# EAGLE schematic controller (EAGLE 6.6.0)
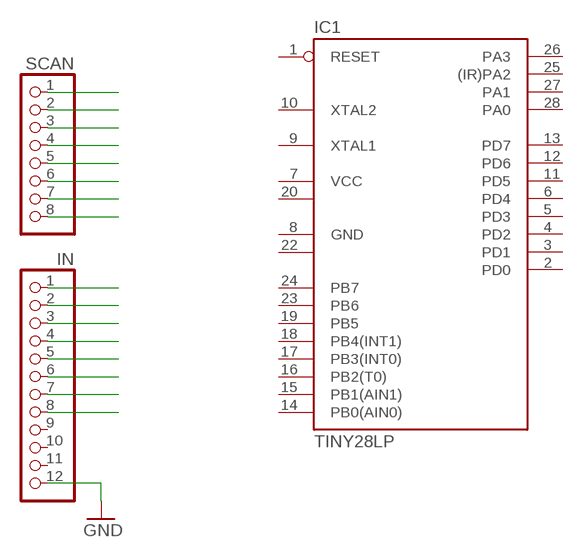
[diagram p0: schematic, sheet 1]

## Parts
IC1  TINY28LP  [DIL28-3]
IN  PINHD-1X12/90  [1X12/90]
SCAN  PINHD-1X8/90  [1X08/90]

## Nets
GND: IN.12
N$1: SCAN.1
N$2: SCAN.2
N$3: SCAN.3
N$4: SCAN.4
N$5: SCAN.5
N$6: SCAN.6
N$7: SCAN.7
N$8: SCAN.8
N$9: IN.1
N$10: IN.2
N$11: IN.3
N$12: IN.4
N$13: IN.5
N$14: IN.6
N$15: IN.7
N$16: IN.8
Unconnected: IC1.1(RESET) IC1.2(PD0) IC1.3(PD1) IC1.4(PD2) IC1.5(PD3) IC1.6(PD4) IC1.9(XTAL1) IC1.10(XTAL2) IC1.11(PD5) IC1.12(PD6) IC1.13(PD7) IC1.14(PB0(AIN0)) IC1.15(PB1(AIN1)) IC1.16(PB2(T0)) IC1.17(PB3(INT0)) IC1.18(PB4(INT1)) IC1.19(PB5) IC1.21(NC1) IC1.23(PB6) IC1.24(PB7) IC1.25((IR)PA2) IC1.26(PA3) IC1.27(PA1) IC1.28(PA0) IN.9 IN.10 IN.11

## Power pins joined to a net without a drawn wire
GND: IC1.8(GND)
GND1: IC1.22(GND1)
VCC: IC1.7(VCC)
VCC1: IC1.20(VCC1)

## Library data of the parts
IC1 = atmel:TINY28*P: MICROCONTROLLER 1.8 V 2 Kbytes FLASH; OC_FARNELL: unknown; OC_NEWARK: unknown
IN = pinhead:PINHD-1X12: PIN HEADER
SCAN = pinhead:PINHD-1X8: PIN HEADER